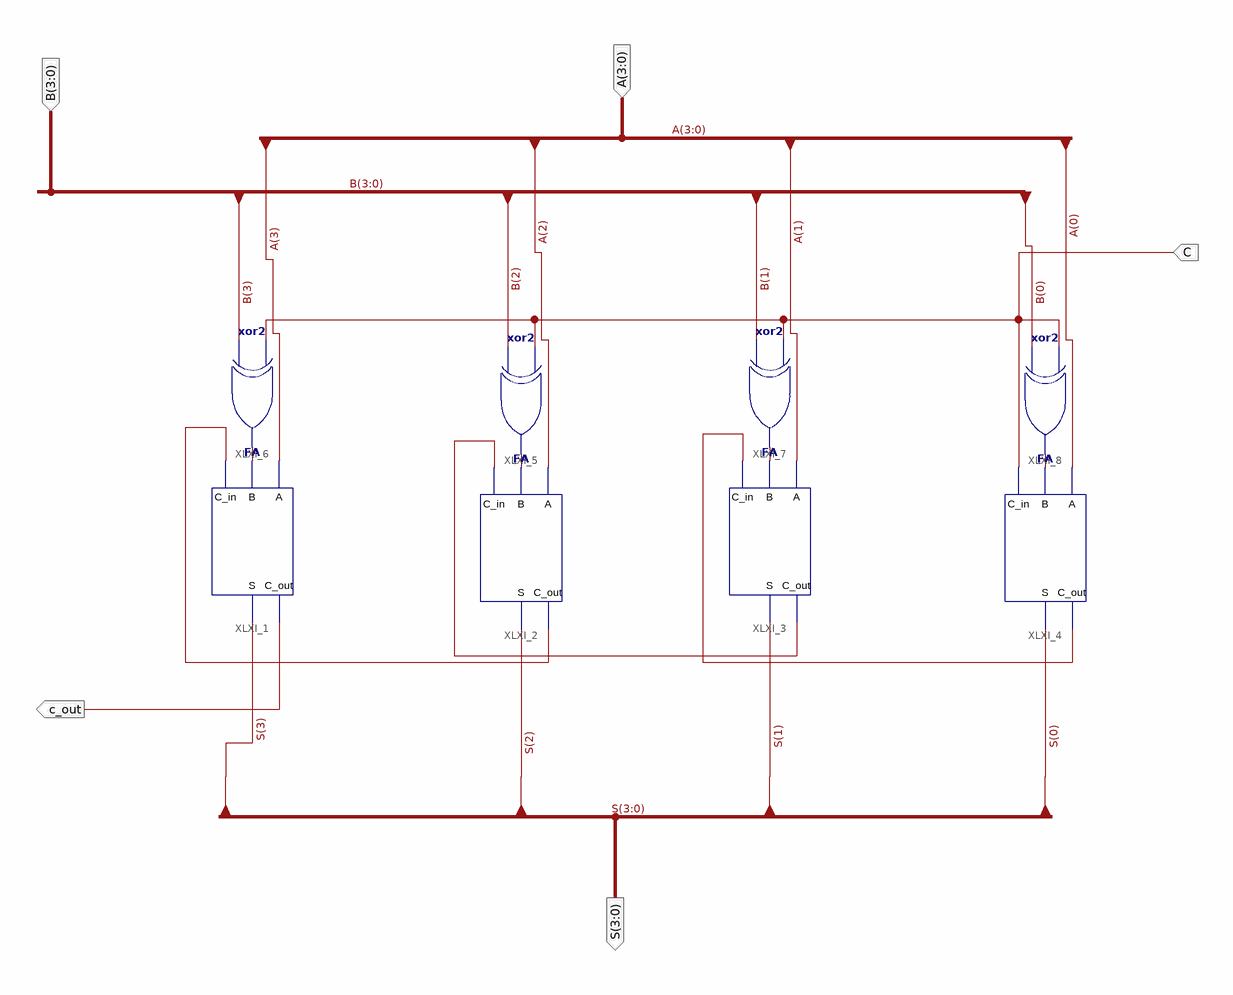
[diagram p0: schematic sheet 1]
// Xilinx ISE schematic AddSubUnit.sch (spartan3e) as structural Verilog: 8 symbols, 5 ports
module AddSubUnit (
  input  C,
  input  [3:0] A,
  input  [3:0] B,
  output c_out,
  output [3:0] S
);

  wire XLXN_1, XLXN_2, XLXN_3, XLXN_4, XLXN_15, XLXN_17, XLXN_40;

  FA XLXI_1 (.A(A[3]), .B(XLXN_1), .C_in(XLXN_15), .C_out(c_out), .S(S[3]));
  FA XLXI_2 (.A(A[2]), .B(XLXN_2), .C_in(XLXN_40), .C_out(XLXN_15), .S(S[2]));
  FA XLXI_3 (.A(A[1]), .B(XLXN_3), .C_in(XLXN_17), .C_out(XLXN_40), .S(S[1]));
  FA XLXI_4 (.A(A[0]), .B(XLXN_4), .C_in(C), .C_out(XLXN_17), .S(S[0]));
  xor XLXI_5 (XLXN_2, B[2], C);
  xor XLXI_6 (XLXN_1, B[3], C);
  xor XLXI_7 (XLXN_3, B[1], C);
  xor XLXI_8 (XLXN_4, B[0], C);
endmodule
